# EAGLE schematic Diode as a voltage regulator (EAGLE 9.6.2)
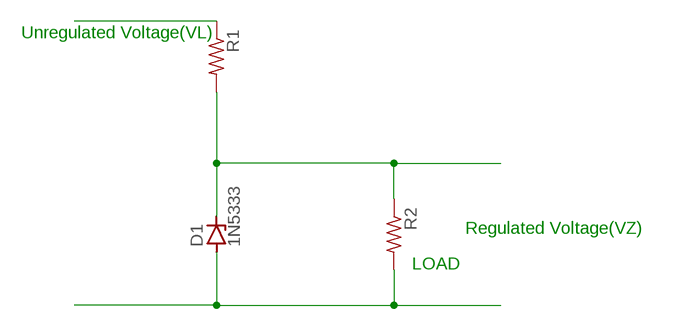
[diagram p0: schematic, sheet 1]

## Parts
D1  1N5333  [C1702-15]
R1  R-US_R0805  [R0805]
R2  R-US_R0805  [R0805]

## Nets
N$1: D1.C R1.2 R2.1
N$2: D1.A R2.2
N$4: R1.1

## Notes on the sheet
- Unregulated Voltage(VL)
- Regulated Voltage(VZ)
- LOAD

## Library data of the parts
D1 = diode:1N5333: Z DIODE 3.3 V, 5W, 5 percent (Motorola)
R1 R2 = rcl:R-US_: RESISTOR, American symbol; SPICEPREFIX: R